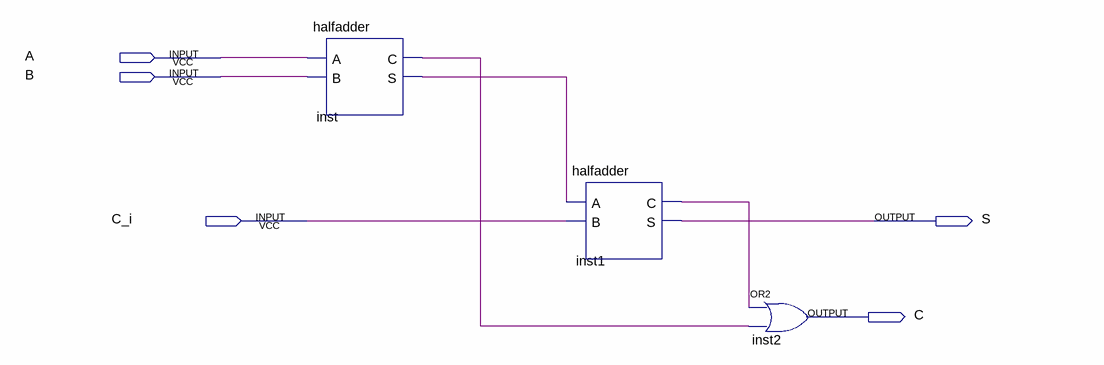
[diagram p0: schematic sheet]
// Quartus schematic fulladder.bdf as structural Verilog: 3 symbols, 5 pins
module fulladder (
  input  A,
  input  B,
  input  C_i,
  output S,
  output C
);

  wire inst1_c, inst_c, inst_s;

  halfadder inst (.A(A), .B(B), .C(inst_c), .S(inst_s));
  halfadder inst1 (.A(inst_s), .B(C_i), .C(inst1_c), .S(S));
  or inst2 (C, inst1_c, inst_c);
endmodule
